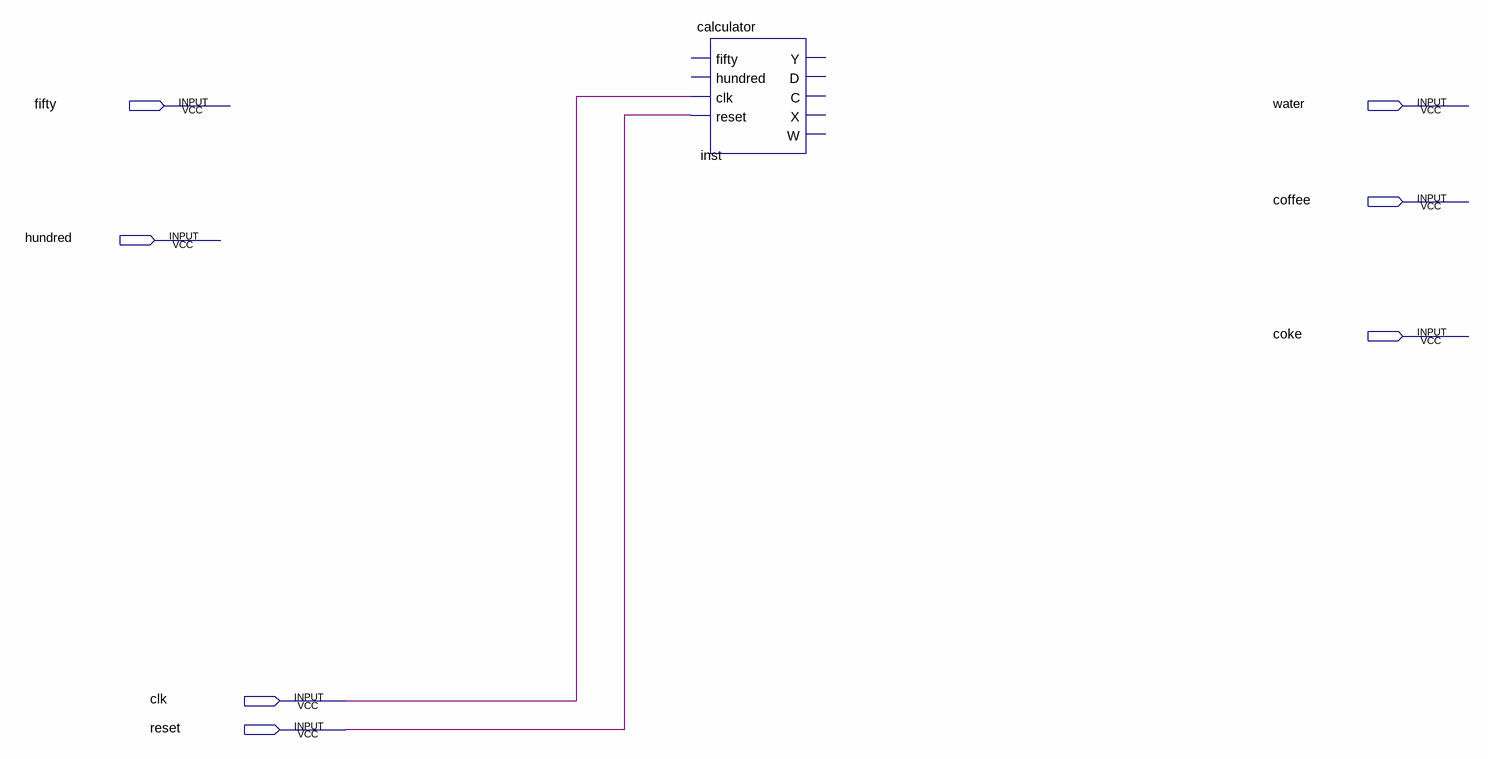
[diagram p0: schematic sheet]
// Quartus schematic total_calculator.bdf as structural Verilog: 1 symbols, 7 pins
module total_calculator (
  input  fifty,
  input  water,
  input  coffee,
  input  hundred,
  input  coke,
  input  clk,
  input  reset
);

  calculator inst (.clk(clk), .reset(reset));  // open: fifty, hundred, Y, D, C, X, W
endmodule
